# EasyEDA Pro project ProPrj_stm32f103rct6拓展版_2026-05-28.epro

# Schematic Schematic1
Board Name: Board1; Create Date: 2026-05-18; Page Name: P1; Project Name: stm32f103rct6拓展版; Schematic Name: Schematic1; Update Date: 2026-05-19; Company: 嘉立创EDA; Page Size: A4; Version: V1.0
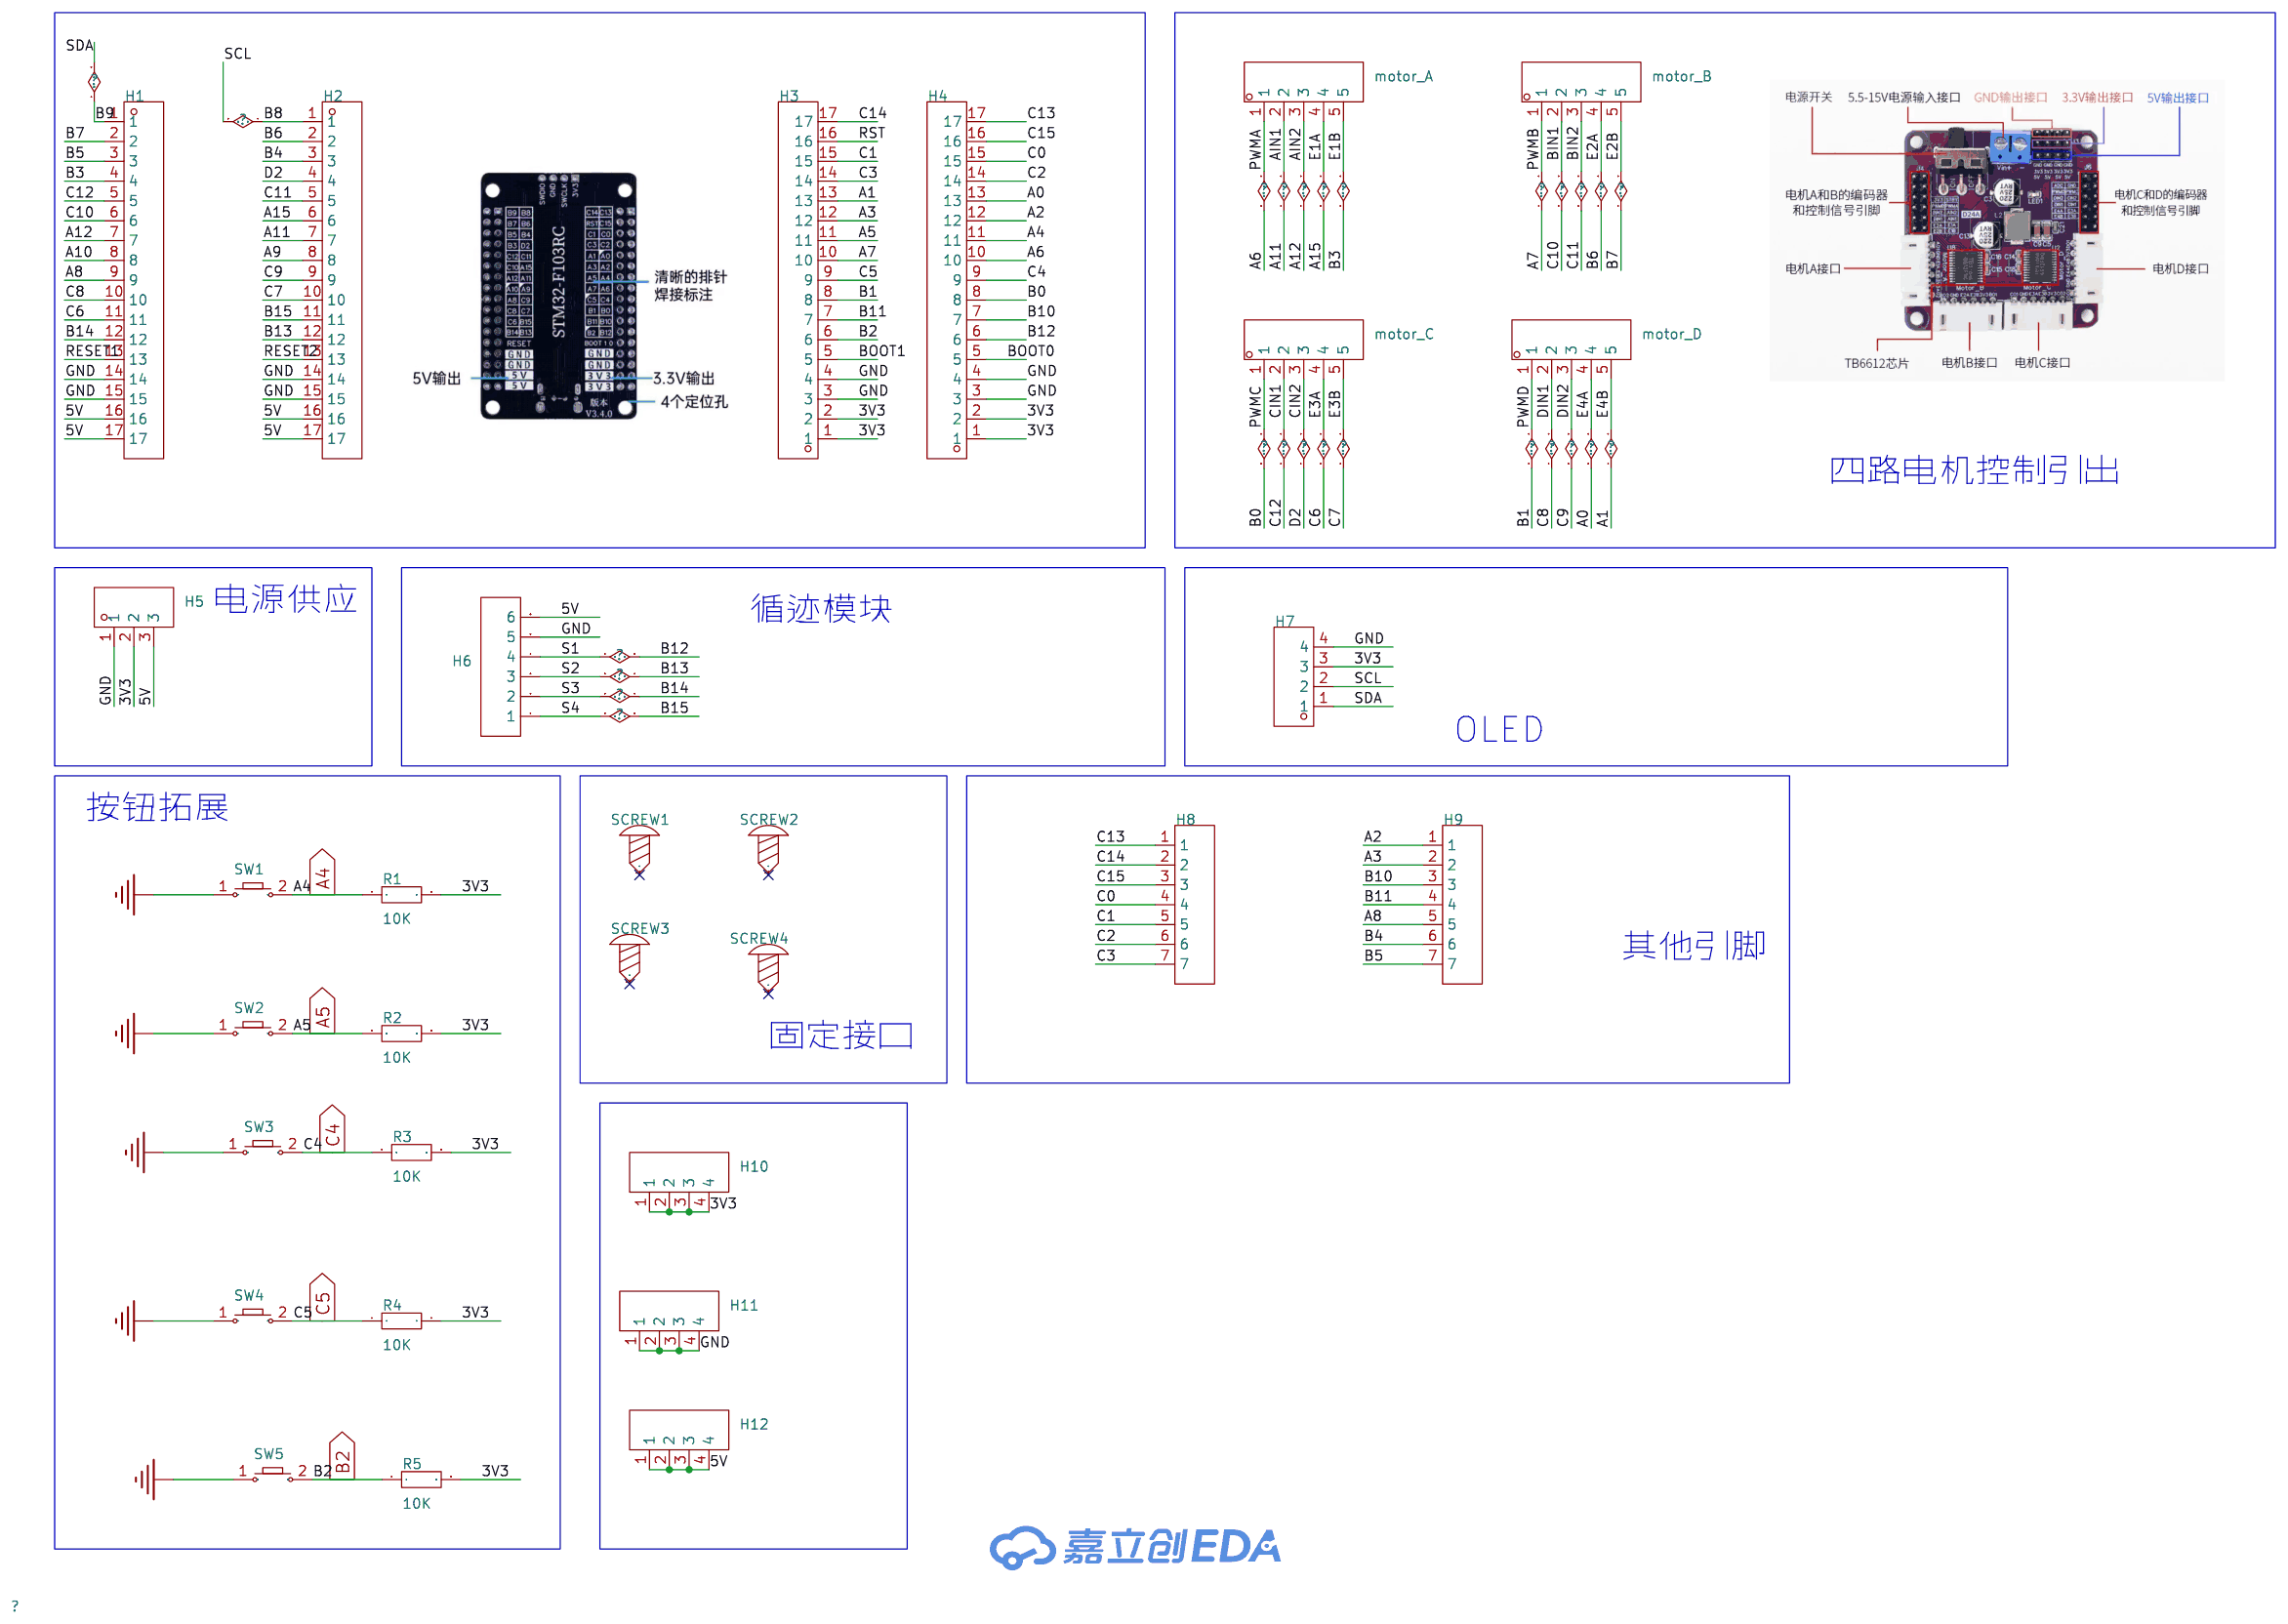
[diagram p0: schematic sheet]

## Parts
H1  -  [HDR-TH_17P-P2.54-V-F]
H2  -  [HDR-TH_17P-P2.54-V-F]
H3  -  [HDR-TH_17P-P2.54-V-F]
H4  -  [HDR-TH_17P-P2.54-V-F]
H5  -  [HDR-TH_3P-P2.54-V-M]
H6  -  [HDR-TH_6P-P2.54-V-M-1]
H7  -  [HDR-TH_4P-P2.54-V-F]
H8  -  [HDR-TH_7P-P2.54-V-M]
H9  -  [HDR-TH_7P-P2.54-V-M]
H10  -  [HDR-TH_4P-P2.54-V-M]
H11  -  [HDR-TH_4P-P2.54-V-M]
H12  -  [HDR-TH_4P-P2.54-V-M]
motor_A  -  [HDR-TH_5P-P2.54-V-M]
motor_B  -  [HDR-TH_5P-P2.54-V-M]
motor_C  -  [HDR-TH_5P-P2.54-V-M]
motor_D  -  [HDR-TH_5P-P2.54-V-M]
R1  10K  [R0805]
R2  10K  [R0805]
R3  10K  [R0805]
R4  10K  [R0805]
R5  10K  [R0805]
SCREW1  -  [M3螺丝]
SCREW2  -  [M3螺丝]
SCREW3  -  [M3螺丝]
SCREW4  -  [M3螺丝]
SW1  -  [Key_SMD_3x4x2]
SW2  -  [Key_SMD_3x4x2]
SW3  -  [Key_SMD_3x4x2]
SW4  -  [Key_SMD_3x4x2]
SW5  -  [Key_SMD_3x4x2]

## Library data of the parts
H1-H4 = HDR-F_2.54_1x17P: Supplier Part: C2897380; Supplier Footprint: 插件
H5 = HDR-M_2.54_1x3P: Supplier Part: C2937625; Supplier Footprint: 插件
H6 = HDR-M_2.54_1x6P: Supplier Part: C37208; Supplier Footprint: 插件
H7 = HDR-F_2.54_1x4P: Supplier Part: C2718488; Supplier Footprint: 插件
H8 H9 = HDR-M_2.54_1x7P: Supplier Part: C492406; Supplier Footprint: 插件
H10-H12 = HDR-M_2.54_1x4P: Supplier Part: C492403; Supplier Footprint: 插件
motor_A motor_B motor_C motor_D = HDR-M_2.54_1x5P: Supplier Part: C358687; Supplier Footprint: 插件
R1-R5 = Res_0805: Supplier Footprint: 0805
SCREW1-SCREW4 = M3螺丝: Supplier Footprint: 插件
SW1-SW5 = Key_SMD_3x4x2: Supplier Footprint: SMD

## Nets
3V3: H3.1 H3.2 H4.1 H4.2 H5.2 H7.3 H10.1 H10.2 H10.3 H10.4 R1.2 R2.2 R3.2 R4.2 R5.2
5V: H1.16 H1.17 H2.16 H2.17 H5.3 H6.6 H12.1 H12.2 H12.3 H12.4
GND: H1.14 H1.15 H2.14 H2.15 H3.3 H3.4 H4.3 H4.4 H5.1 H6.5 H7.4 H11.1 H11.2 H11.3 H11.4 SW1.1 SW2.1 SW3.1 SW4.1 SW5.1
A0: H4.13 motor_D.4
A1: H3.13 motor_D.5
A2: H4.12 H9.1
A3: H3.12 H9.2
A4: H4.11 R1.1 SW1.2
A5: H3.11 R2.1 SW2.2
A6: H4.10 motor_A.1
A7: H3.10 motor_B.1
A8: H1.9 H9.5
A9: H2.8
A10: H1.8
A11: H2.7 motor_A.2
A12: H1.7 motor_A.3
A15: H2.6 motor_A.4
B0: H4.8 motor_C.1
B1: H3.8 motor_D.1
B2: H3.6 R5.1 SW5.2
B3: H1.4 motor_A.5
B4: H2.3 H9.6
B5: H1.3 H9.7
B6: H2.2 motor_B.4
B7: H1.2 motor_B.5
B8: H2.1 H7.2
B9: H1.1 H7.1
B10: H4.7 H9.3
B11: H3.7 H9.4
B12: H4.6 H6.4
B13: H2.12 H6.3
B14: H1.12 H6.2
B15: H2.11 H6.1
BIN1: H1.6 motor_B.2
BIN2: H2.5 motor_B.3
BOOT0: H4.5
BOOT1: H3.5
C0: H4.15 H8.4
C1: H3.15 H8.5
C2: H4.14 H8.6
C3: H3.14 H8.7
C4: H4.9 R3.1 SW3.2
C5: H3.9 R4.1 SW4.2
C6: H1.11 motor_C.4
C7: H2.10 motor_C.5
C8: H1.10 motor_D.2
C9: H2.9 motor_D.3
C12: H1.5 motor_C.2
C13: H4.17 H8.1
C14: H3.17 H8.2
C15: H4.16 H8.3
CIN2: H2.4 motor_C.3
RESET1: H1.13
RESET2: H2.13
RST: H3.16

Not connected (* = marked no-connect by the designer): SCREW1 1*; SCREW2 1*; SCREW3 1*; SCREW4 1*

## Notes on the sheet
- 四路电机控制引出
- 电源供应
- 循迹模块
- OLED
- 按钮拓展
- 其他引脚
- 固定接口

# Board PCB1
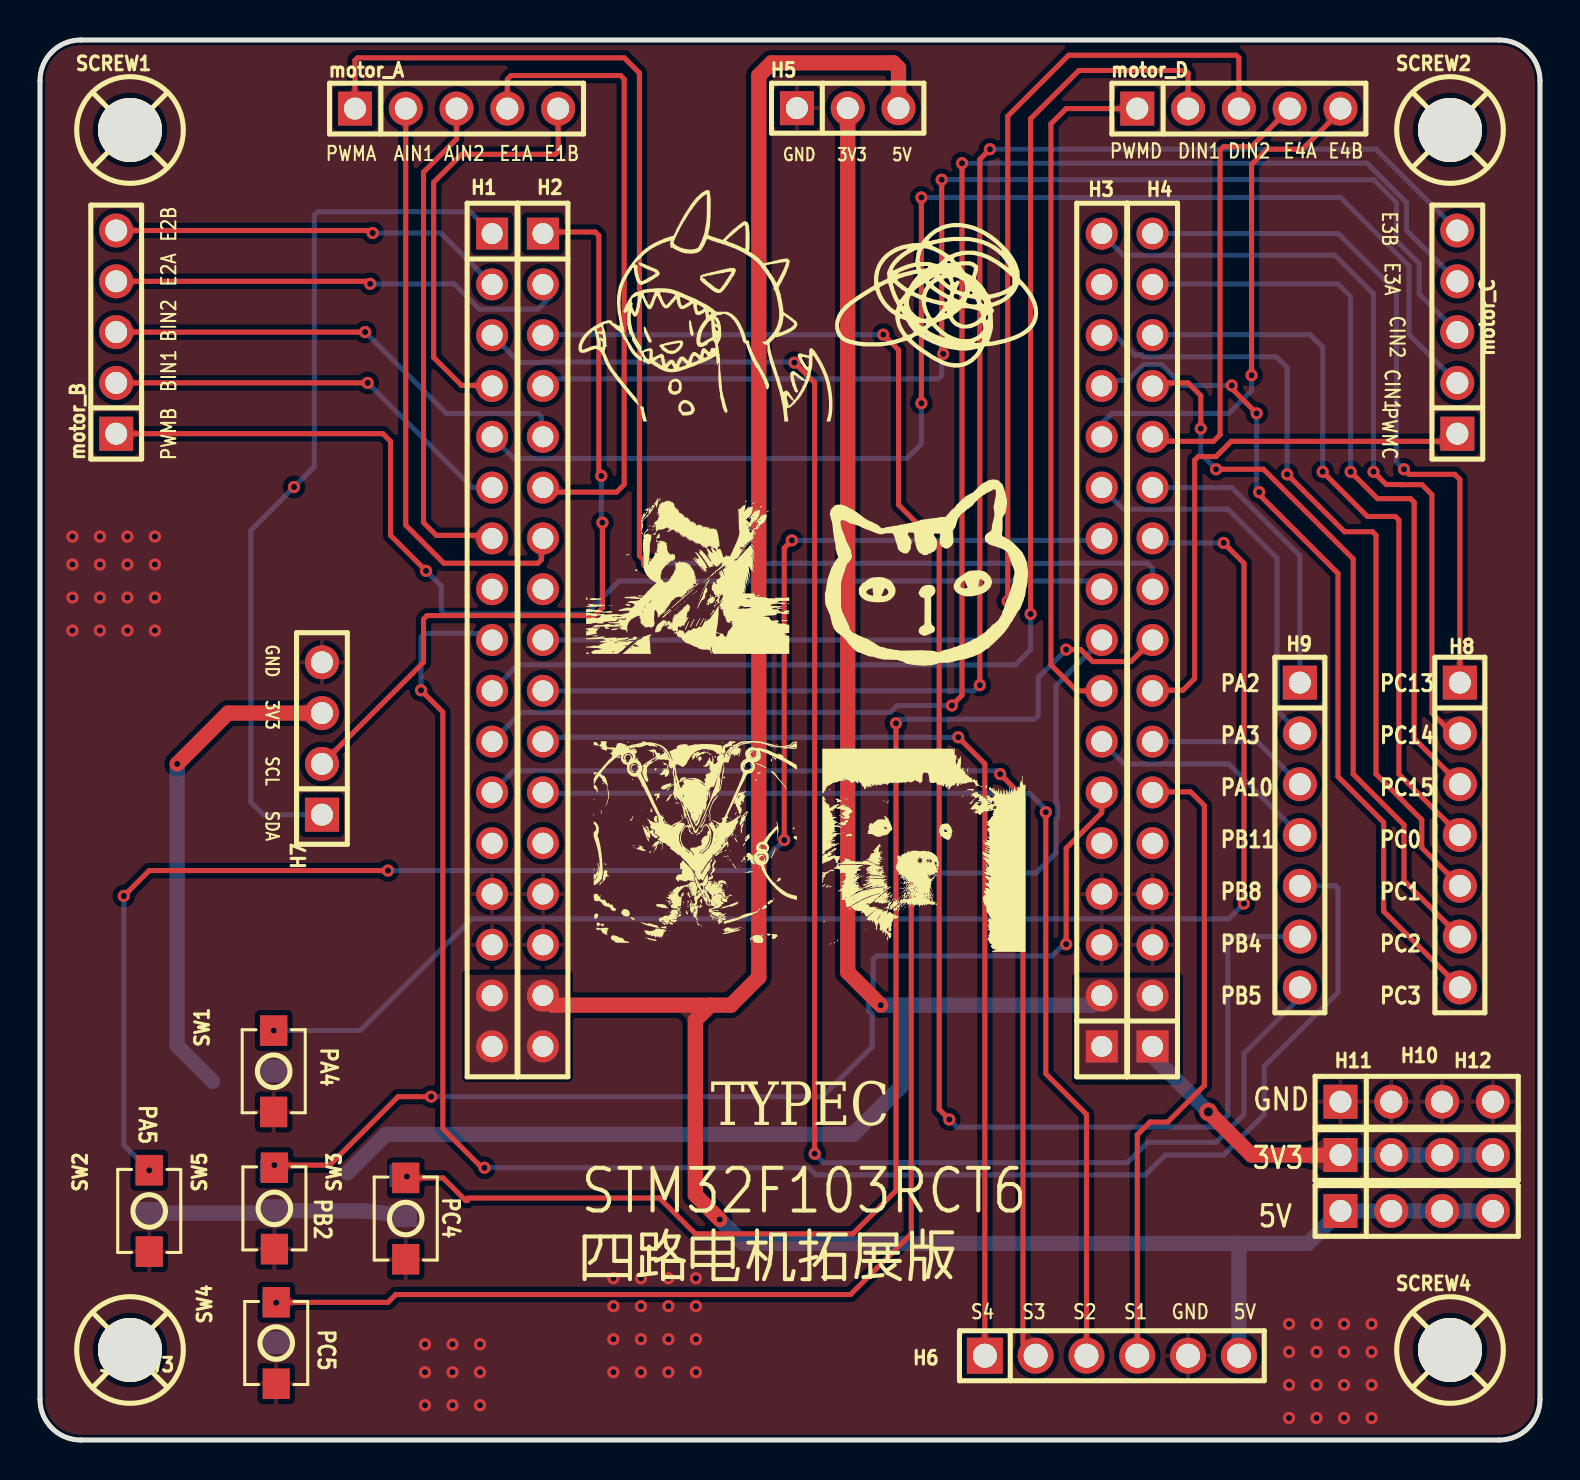
[diagram p1: board, top side]
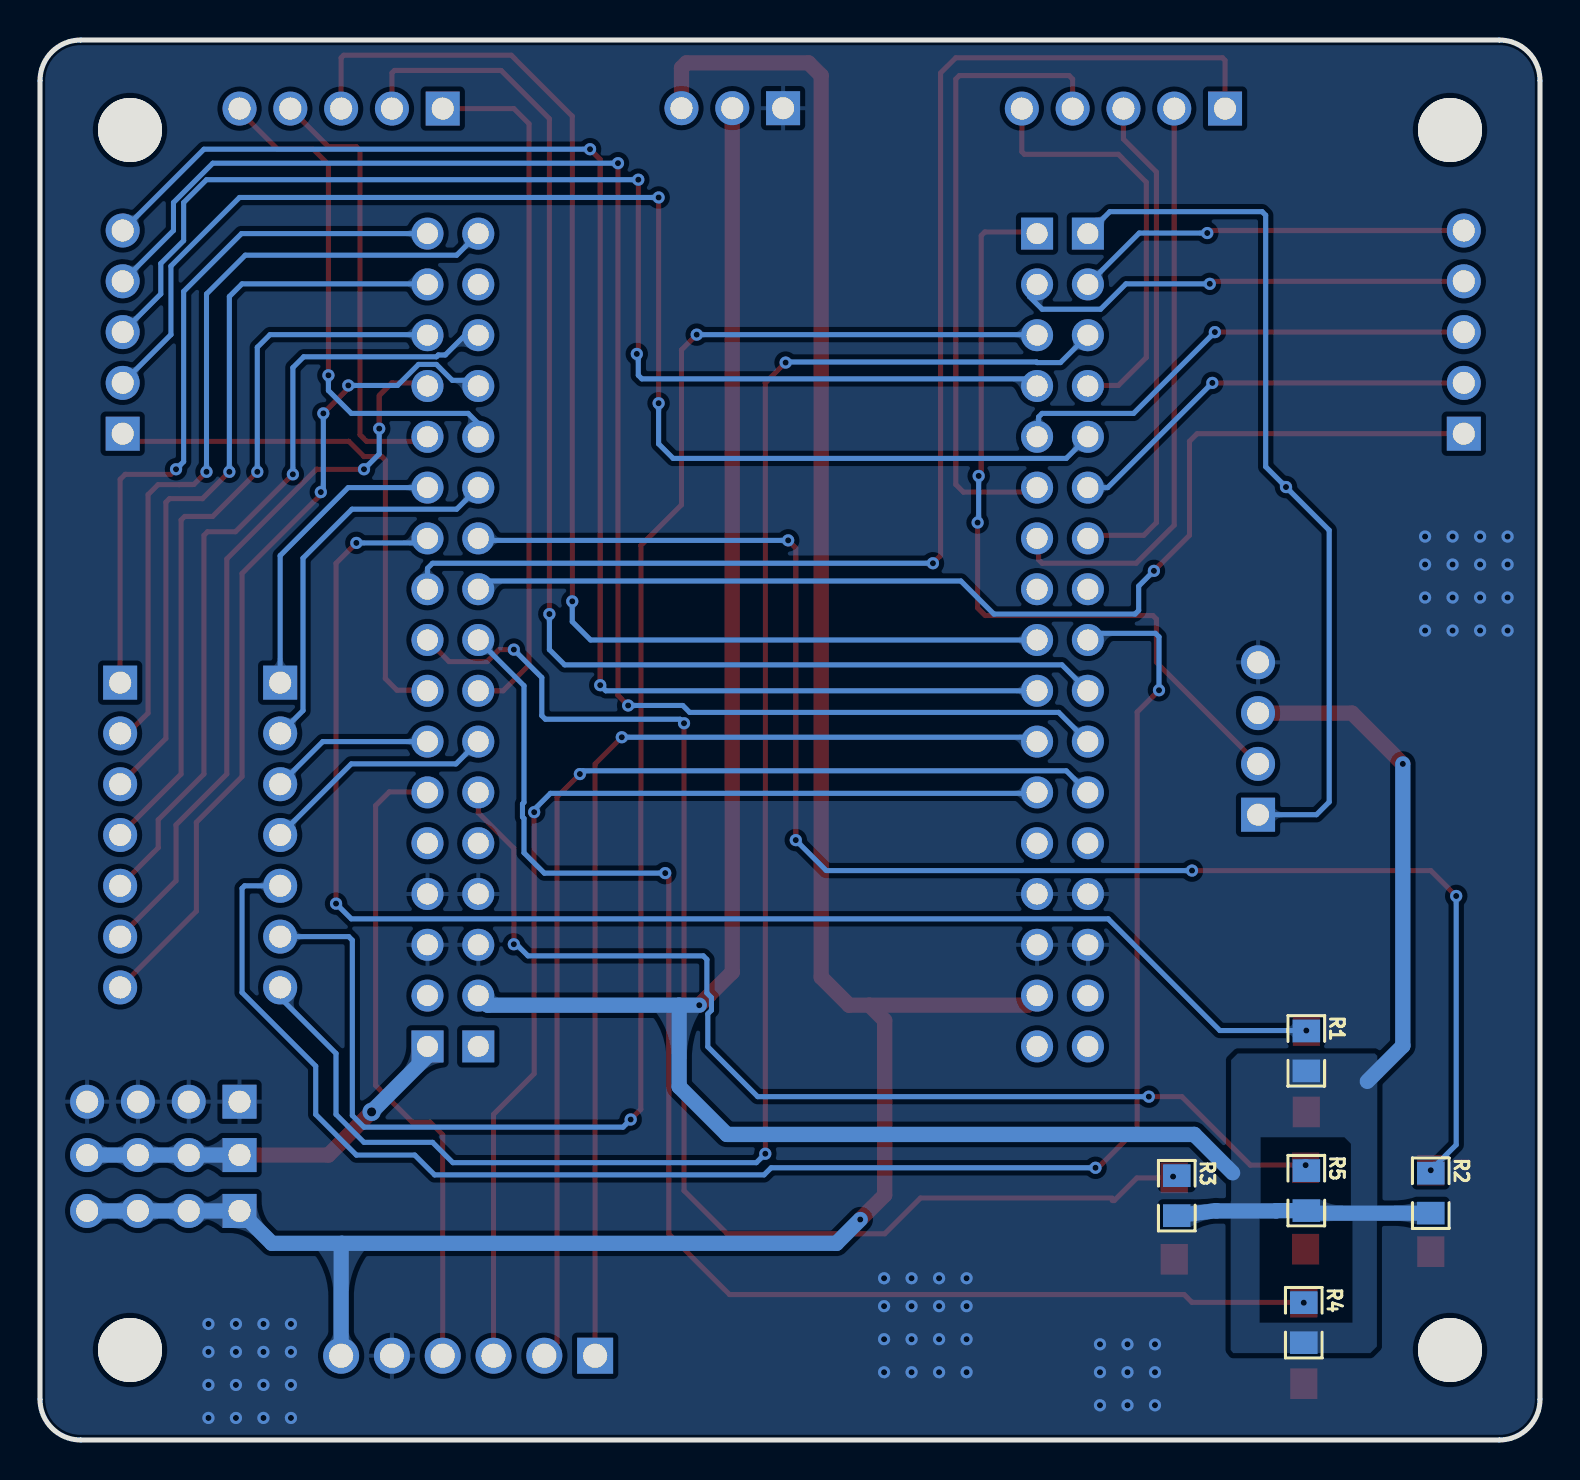
[diagram p2: board, bottom side, seen from below]

Outline 75 x 70 mm; copper layers: Top Layer, Bottom Layer. Coordinates in mm from the lower left corner of the outline.
Outline path: 0,67.97 0,2.03 arc(0.6,0.6) 2.03,0 72.97,0 arc(74.4,0.6) 75,2.03 75,67.97 arc(74.4,69.4) 72.97,70 2.03,70 arc(0.6,69.4) 0,67.97
Stack: Top Layer 0.035mm / Dielectric1 1.51mm FR4 er 4.5 / Bottom Layer 0.035mm

## Design rules (mm)
template: JLCPCB Capability(Two Layers Board)
spacing copperThickness1oz (default): track to track 0.102, other pairs 0.152 to 0.3
spacing copperThickness2oz: track to track 0.203, other pairs 0.152 to 0.3
track width copperThickness1oz (default): min 0.127, default 0.254, max 2.54
track width copperThickness2oz: min 0.203, default 0.254, max 2.54
differential pair differentialPair (default): width min 0.127, default 0.254, max 2.54; gap min 0.152, default 0.152
via viaSize (default): diameter min 0.5, default 0.61, max 10; hole min 0.3, default 0.305, max 6.3

## Placement (name value [footprint] x y rotation side)
H1  -  [HDR-TH_17P-P2.54-V-F]  22.61 40 270 top
H2  -  [HDR-TH_17P-P2.54-V-F]  25.15 40 270 top
H3  -  [HDR-TH_17P-P2.54-V-F]  53.09 40 90 top
H4  -  [HDR-TH_17P-P2.54-V-F]  55.63 40 90 top
H5  -  [HDR-TH_3P-P2.54-V-M]  40.39 66.59 0 top
H6  -  [HDR-TH_6P-P2.54-V-M-1]  53.59 4.21 0 top
H7  -  [HDR-TH_4P-P2.54-V-F]  14.1 35.08 90 top
H8  -  [HDR-TH_7P-P2.54-V-M]  70.99 30.25 270 top
H9  -  [HDR-TH_7P-P2.54-V-M]  62.99 30.25 270 top
H10  -  [HDR-TH_4P-P2.54-V-M]  68.83 14.25 0 top
H11  -  [HDR-TH_4P-P2.54-V-M]  68.83 16.91 0 top
H12  -  [HDR-TH_4P-P2.54-V-M]  68.83 11.45 0 top
motor_A  -  [HDR-TH_5P-P2.54-V-M]  20.83 66.57 0 top
motor_B  -  [HDR-TH_5P-P2.54-V-M]  3.81 55.39 90 top
motor_C  -  [HDR-TH_5P-P2.54-V-M]  70.87 55.39 90 top
motor_D  -  [HDR-TH_5P-P2.54-V-M]  59.94 66.57 0 top
R1  10K  [R0805]  11.68 19.45 270 bottom
R2  10K  [R0805]  5.46 12.34 270 bottom
R3  10K  [R0805]  18.16 12.22 270 bottom
R4  10K  [R0805]  11.81 5.87 270 bottom
R5  10K  [R0805]  11.68 12.47 270 bottom
SCREW1  -  [M3螺丝]  4.5 65.5 0 top
SCREW2  -  [M3螺丝]  70.5 65.5 0 top
SCREW3  -  [M3螺丝]  4.5 4.5 0 top
SCREW4  -  [M3螺丝]  70.5 4.5 0 top
SW1  -  [Key_SMD_3x4x2]  11.68 18.44 90 top
SW2  -  [Key_SMD_3x4x2]  5.46 11.45 90 top
SW3  -  [Key_SMD_3x4x2]  18.29 11.07 90 top
SW4  -  [Key_SMD_3x4x2]  11.81 4.85 90 top
SW5  -  [Key_SMD_3x4x2]  11.72 11.58 90 top

## Footprints (pads in the part's own frame, mm; a bottom-side part is the same pattern mirrored in y, then rotated)
HDR-TH_3P-P2.54-V-M
  rect 1.7x1.7 hole 1.1: 1(-2.54,0)
  round 1.7 hole 1.1: 2(0,0) 3(2.54,0)
HDR-TH_4P-P2.54-V-F
  rect 1.7x1.7 hole 1.1: 1(-3.81,0)
  round 1.7 hole 1.1: 2(-1.27,0) 3(1.27,0) 4(3.81,0)
HDR-TH_4P-P2.54-V-M
  rect 1.7x1.7 hole 1.1: 1(-3.81,0)
  round 1.7 hole 1.1: 2(-1.27,0) 3(1.27,0) 4(3.81,0)
HDR-TH_5P-P2.54-V-M
  rect 1.7x1.7 hole 1.1: 1(-5.08,0)
  round 1.7 hole 1.1: 2(-2.54,0) 3(0,0) 4(2.54,0) 5(5.08,0)
HDR-TH_6P-P2.54-V-M-1
  rect 1.8x1.8 hole 1.2: 1(-6.35,0)
  round 1.8 hole 1.2: 2(-3.81,0) 3(-1.27,0) 4(1.27,0) 5(3.81,0) 6(6.35,0)
HDR-TH_7P-P2.54-V-M
  rect 1.7x1.7 hole 1.1: 1(-7.62,0)
  round 1.7 hole 1.1: 2(-5.08,0) 3(-2.54,0) 4(0,0) 5(2.54,0) 6(5.08,0) 7(7.62,0)
HDR-TH_17P-P2.54-V-F
  rect 1.6x1.6 hole 1.05: 1(-20.32,0)
  round 1.6 hole 1.05: 2(-17.78,0) 3(-15.24,0) 4(-12.7,0) 5(-10.16,0) 6(-7.62,0) 7(-5.08,0) 8(-2.54,0) 9(0,0) 10(2.54,0) 11(5.08,0) 12(7.62,0) 13(10.16,0) 14(12.7,0) 15(15.24,0) 16(17.78,0) 17(20.32,0)
Key_SMD_3x4x2
  rect 1.53x1.36 smd: 1(-2.035,0) 2(2.035,0)
M3螺丝
  round 3.2 hole 3.2: 1(0,0)
R0805
  rect 1.133x1.377 smd: 1(-1,0) 2(1,0)

## Nets
As in the schematic.

Pads without a net: SCREW1 1; SCREW2 1; SCREW3 1; SCREW4 1

## Via types
v1: diameter 0.61, hole 0.305, Top Layer to Bottom Layer, 115 vias
v2: diameter 0.914, hole 0.457, Top Layer to Bottom Layer, 1 via

## Routing (per net, layer and track width the routed paths; a pad name or vN(x,y) marks a point on that pad's centre or on a via; arc(x,y) is an arc through that point)
3V3: length 147.6
  Top Layer w0.762: v1(42.04,21.74) 40.39,23.39 H5.2 ; H7.3 9.4,36.34 v1(6.86,33.81) ; v2(58.42,16.41) 60.58,14.25 H10.1
  Bottom Layer w0.762: 15.37,13.36 17.29,15.28 40.66,15.28 43.04,17.67 43.04,21.74 ; v2(58.42,16.41) 55.63,19.2 H4.1 ; R2.2 11.56,11.34 R5.2 13.19,11.47 13.2,11.45 16.18,11.45 16.19,11.47 R3.2 ; v1(42.04,21.74) 43.04,21.74 ; 43.04,21.74 52.61,21.74 H3.2 ; 8.64,17.93 6.86,19.71 v1(6.86,33.81) ; H10.4 H10.3 H10.2 H10.1
5V: length 123
  Top Layer w0.762: v1(33.99,11.02) 32.77,12.25 32.77,20.98 33.53,21.74 ; 33.53,21.74 34.54,21.74 35.94,23.14 35.94,68.22 36.58,68.86 42.67,68.86 42.93,68.6 H5.3 ; 33.53,21.74 25.63,21.74 H2.16
  Bottom Layer w0.762: 59.91,9.83 63.4,9.83 H12.1 H12.2 H12.3 H12.4 ; 59.91,9.83 35.18,9.83 v1(33.99,11.02) ; 59.91,9.83 59.94,9.8 H6.6
GND:
  vias: v1(1.62,45.17) v1(1.62,43.77) v1(1.62,42.12) v1(1.62,40.47) v1(3,45.17) v1(3,43.77) v1(3,42.12) v1(3,40.47) v1(4.37,45.17) v1(4.37,43.77) v1(4.37,42.12) v1(4.37,40.47) v1(5.75,45.17) v1(5.75,43.77) v1(5.75,42.12) v1(5.75,40.47) v1(19.25,4.79) v1(19.25,3.39) v1(19.25,1.74) v1(20.63,4.79) v1(20.63,3.39) v1(20.63,1.74) v1(22,4.79) v1(22,3.39) v1(22,1.74) v1(28.67,8.09) v1(28.67,6.69) v1(28.67,5.04) v1(28.67,3.39) v1(30.05,8.09) v1(30.05,6.69) v1(30.05,5.04) v1(30.05,3.39) v1(31.42,8.09) v1(31.42,6.69) v1(31.42,5.04) v1(31.42,3.39) v1(32.8,8.09) v1(32.8,6.69) v1(32.8,5.04) v1(32.8,3.39) v1(62.45,5.8) v1(62.45,4.4) v1(62.45,2.75) v1(62.45,1.1) v1(63.83,5.8) v1(63.83,4.4) v1(63.83,2.75) v1(63.83,1.1) v1(65.2,5.8) v1(65.2,4.4) v1(65.2,2.75) v1(65.2,1.1) v1(66.58,5.8) v1(66.58,4.4) v1(66.58,2.75) v1(66.58,1.1)
A0: length 22.2
  Top Layer w0.254: H4.13 55.85,49.93 58.67,49.93 59,50.26 59,64.49 59.18,64.67 60.58,64.67 motor_D.4
A1: length 25.8
  Top Layer w0.254: motor_D.5 65.02,66.44 63.12,64.54 61.34,64.54 60.58,63.78 v1(60.58,53.24)
  Bottom Layer w0.254: v1(60.58,53.24) 60.58,52.47 59.44,51.33 53.59,51.33 53.09,50.82 H3.13
A2: length 15.1
  Bottom Layer w0.254: H9.1 62.99,44.22 59.59,47.62 H4.12
A3: length 19.5
  Bottom Layer w0.254: H3.12 54.16,46.54 59.4,46.54 61.85,44.09 61.85,36.47 H9.2
A4: length 73.2
  Top Layer w0.254: v1(59.18,44.85) 60.2,43.84 v1(60.2,26.82)
  Bottom Layer w0.254: v1(11.68,20.47) 16,20.47 21.59,26.06 59.44,26.06 v1(60.2,26.82) ; v1(59.18,44.85) 55.85,44.85 H4.11
A5: length 79.1
  Top Layer w0.254: v1(4.19,27.2) 5.46,28.47 v1(17.4,28.47) ; v1(37.59,44.98) 37.21,44.6 v1(37.21,30)
  Bottom Layer w0.254: v1(4.19,27.2) 4.19,14.76 v1(5.46,13.49) ; v1(37.59,44.98) 52.99,44.98 H3.11 ; v1(37.21,30) 35.69,28.47 v1(17.4,28.47)
A6: length 68.1
  Top Layer w0.254: v1(30.35,43.84) 29.97,44.22 29.97,68.35 29.21,69.11 15.88,69.11 15.75,68.98 motor_A.1
  Bottom Layer w0.254: v1(30.35,43.84) 55.37,43.84 55.63,43.58 H4.10
A7: length 57.3
  Top Layer w0.254: motor_B.1 17.14,50.31 17.53,49.93 17.53,45.23 v1(19.3,43.46)
  Bottom Layer w0.254: v1(19.3,43.46) 20.07,42.69 20.07,41.48 20.25,41.3 27.31,41.3 28.96,42.95 52.68,42.95 H3.10
A8: length 86.9
  Top Layer w0.254: v1(22.22,13.61) 22.1,13.61 20.14,15.57 20.14,36.4 v1(19.05,37.49)
  Bottom Layer w0.254: H9.5 64.77,27.71 64.9,27.58 64.9,22.38 61.21,18.69 61.21,16.28 59.18,14.25 56.26,14.25 55.27,13.26 38.8,13.26 38.44,13.61 v1(22.22,13.61) ; H1.9 22.27,40.33 19.23,40.33 19.05,40.16 v1(19.05,37.49)
A11: length 29.6
  Top Layer w0.254: H2.7 25.07,45.01 25.07,44.02 24.89,43.84 20.19,43.84 18.29,45.74 motor_A.2
A12: length 25.1
  Top Layer w0.254: motor_A.3 20.83,65.05 19.18,63.4 19.18,45.87 19.81,45.23 22.45,45.23 H1.7
A15: length 32
  Top Layer w0.254: motor_A.4 23.37,68.04 23.55,68.22 29.03,68.22 29.21,68.04 29.21,47.78 28.83,47.39 25.37,47.39 H2.6
B0: length 27
  Top Layer w0.254: motor_C.1 70.49,49.93 59.56,49.93 58.8,49.17 57.91,49.17 57.73,48.99 57.73,38.07 57.15,37.49 55.65,37.49 H4.8
B1: length 34.8
  Top Layer w0.254: H3.8 51.84,37.46 50.55,38.76 50.55,65.81 51.31,66.57 motor_D.1
B2: length 55.2
  Top Layer w0.254: H3.6 53.09,31.37 51.31,29.59 v1(51.31,24.79) ; v1(19.56,17.17) 17.91,17.17 14.48,13.74 v1(11.72,13.74)
  Bottom Layer w0.254: v1(51.31,24.79) 51.18,24.79 50.6,24.21 41.84,24.21 41.66,24.03 41.66,22.35 41.43,22.12 41.43,21.49 41.61,21.3 41.61,19.66 39.12,17.17 v1(19.56,17.17)
B3: length 21.3
  Top Layer w0.254: motor_A.5 25.91,64.41 25.78,64.28 21.08,64.28 19.69,62.89 19.69,54.12 21.08,52.73 22.58,52.73 H1.4
B4: length 84.4
  Top Layer w0.254: v1(42.16,55.27) 42.93,54.51 42.93,46.76 44.96,44.73 44.96,16.53 v1(45.47,16.03)
  Bottom Layer w0.254: H2.3 25.17,55.27 v1(42.16,55.27) ; v1(45.47,16.03) 45.85,15.64 58.8,15.64 59.38,16.23 59.38,24.99 59.56,25.17 H9.6
B5: length 85.8
  Top Layer w0.254: v1(38.74,14.31) 38.74,52.86 v1(37.72,53.87)
  Bottom Layer w0.254: H9.7 62.99,22.12 60.2,19.33 60.2,16.28 58.8,14.88 55.37,14.88 54.36,13.87 39.18,13.87 v1(38.74,14.31) ; v1(37.72,53.87) 37.69,53.9 25.18,53.9 25.15,53.87 23.97,53.87 H1.3
B6: length 23.3
  Top Layer w0.254: v1(16.51,57.81) 16.38,57.94 motor_B.4
  Bottom Layer w0.254: v1(16.51,57.81) 20.7,57.81 21.97,56.54 24.89,56.54 25.53,57.17 25.53,57.28 25.15,57.66 H2.2
B7: length 19.9
  Top Layer w0.254: v1(16.64,60.35) 16.51,60.47 motor_B.5
  Bottom Layer w0.254: H1.2 20.04,60.35 v1(16.64,60.35)
B8: length 40.1
  Top Layer w0.254: H7.2 19.18,38.89 19.18,41.04 19.36,41.22 27.74,41.22 28.12,41.6 v1(28.12,45.87) ; H2.1 25.23,60.4 27.76,60.4 27.94,60.22 27.94,48.33 v1(28.07,48.2)
  Bottom Layer w0.254: 28.07,48.16 28.07,45.92 v1(28.12,45.87)
B9: length 43.9
  Bottom Layer w0.254: H1.1 21.51,61.42 13.9,61.42 13.72,61.24 13.72,48.66 v1(12.7,47.65) 10.54,45.49 10.54,31.9 11.18,31.27 H7.1
B10: length 8.2
  Bottom Layer w0.254: H4.7 60.86,34.92 H9.3
B11: length 11.8
  Bottom Layer w0.254: H3.7 54.2,33.81 59.44,33.81 H9.4
B12: length 32.3
  Top Layer w0.254: H4.6 55.65,32.41 57.53,32.41 58.22,31.72 58.22,17.73 56.39,15.9 55.5,15.9 54.86,15.26 H6.4
B13: length 53.6
  Top Layer w0.254: H6.3 52.32,16.28 50.29,18.31 v1(50.29,31.39)
  Bottom Layer w0.254: H2.12 25.19,32.33 49.48,32.33 50.29,31.52 v1(50.29,31.39)
B14: length 55.7
  Top Layer w0.254: H6.2 49.15,4.85 49.15,32.15 v1(48.01,33.3)
  Bottom Layer w0.254: v1(48.01,33.3) 47.84,33.46 23.69,33.46 H1.12
B15: length 52.3
  Top Layer w0.254: H6.1 47.24,33.81 v1(45.91,35.14)
  Bottom Layer w0.254: v1(45.91,35.14) 25.36,35.14 H2.11
BIN1: length 21
  Top Layer w0.254: 3.81,52.86 v1(16.38,52.86)
  Bottom Layer w0.254: H1.6 21.62,47.62 v1(16.38,52.86)
BIN2: length 24
  Top Layer w0.254: motor_B.3 v1(16.26,55.39)
  Bottom Layer w0.254: H2.5 25.07,50.23 25.07,51.15 24.89,51.33 20.32,51.33 v1(16.26,55.39)
C0: length 36.8
  Top Layer w0.254: v1(64.13,48.41) 66.37,46.18 67.77,46.18 67.94,46 67.94,33.3 H8.4
  Bottom Layer w0.254: v1(64.13,48.41) 64.13,54.63 63.5,55.27 55.65,55.27 H4.15
C1: length 40.2
  Top Layer w0.254: v1(62.36,48.28) 65.23,45.41 66.62,45.41 66.8,45.23 66.8,33.3 69.09,31.01 69.09,29.61 H8.5
  Bottom Layer w0.254: v1(62.36,48.28) 62.36,53.62 61.81,54.16 55.18,54.16 55.09,54.25 54.74,54.25 53.75,55.24 H3.15
C2: length 36.5
  Top Layer w0.254: H4.14 55.78,52.86 57.4,52.86 58.04,52.22 v1(58.04,50.57) ; v1(58.8,48.54) 61.18,48.54 65.66,44.05 65.66,33.3 68.2,30.76 68.2,27.96 H8.6
  Bottom Layer w0.254: v1(58.8,48.54) 58.04,49.3 v1(58.04,50.57)
C3: length 42.2
  Top Layer w0.254: H8.7 67.18,26.44 67.18,30.88 64.9,33.17 64.9,43.33 60.96,47.27 v1(60.96,47.39) ; v1(60.83,51.33) 59.59,52.58 v1(59.59,52.73)
  Bottom Layer w0.254: v1(59.59,52.73) 57.12,52.73 56.07,53.78 55.18,53.78 54.38,52.98 53.37,52.98 H3.14 ; v1(60.83,51.33) 60.83,47.52 v1(60.96,47.39)
C4: length 66.2
  Top Layer w0.254: 21.39,12.1 30.98,12.1 32.77,10.31 40.64,10.31 42.8,12.47 42.8,35.96 ; v1(18.35,13.17) 18.41,13.1 20.15,13.1 21.29,11.97 21.39,11.97 ; v1(51.31,39.52) 52.04,39.52 52.64,38.92 54.55,38.92 H4.9
  Bottom Layer w0.254: v1(42.8,35.84) 43,36.04 49.73,36.04 49.91,36.22 49.91,38.12 v1(51.31,39.52)
C5: length 70.4
  Top Layer w0.254: SW4.2 17.4,6.88 17.79,7.27 40.53,7.27 43.56,10.31 43.56,28.17 v1(43.74,28.34)
  Bottom Layer w0.254: H3.9 50.8,37.71 50.8,31.88 50.88,31.81 50.88,31.15 50.8,31.07 50.8,29.36 49.78,28.34 v1(43.74,28.34)
  vias: v1(11.81,6.87)
C6: length 79.1
  Top Layer w0.254: v1(45.59,36.73) 46.1,37.23 v1(46.1,63.84)
  Bottom Layer w0.254: motor_C.4 68.33,60.47 68.33,61.87 66.36,63.84 v1(46.1,63.84) ; v1(45.59,36.73) 42.86,36.73 42.52,36.38 24.07,36.38 H1.11
C7: length 74
  Top Layer w0.254: v1(46.99,37.74) 46.99,64.03 v1(47.5,64.54)
  Bottom Layer w0.254: v1(46.99,37.74) 46.71,37.46 H2.10 ; v1(47.5,64.54) 66.8,64.54 motor_C.5
C8: length 65
  Top Layer w0.254: v1(49.53,41.3) 49.53,66.06 51.94,68.48 57.28,68.48 57.4,68.35 motor_D.2
  Bottom Layer w0.254: v1(49.53,41.3) 49.53,39.52 48.77,38.76 23.9,38.76 H1.10
C9: length 64.3
  Top Layer w0.254: v1(48.39,41.93) 48.39,66.19 51.44,69.24 59.82,69.24 59.94,69.11 motor_D.3
  Bottom Layer w0.254: v1(48.39,41.93) 48.39,40.92 47.47,40 H2.9
C12: length 67.2
  Top Layer w0.254: v1(44.07,62.13) v1(44.07,51.84)
  Bottom Layer w0.254: v1(44.07,62.13) 65.02,62.13 68.45,58.7 68.45,55.27 70.87,52.86 ; v1(44.07,51.84) 44.07,49.81 43.34,49.08 23.69,49.08 H1.5
C13: length 35.6
  Top Layer w0.254: H8.1 70.99,48.03 70.74,48.28 68.45,48.28 v1(68.2,48.54)
  Bottom Layer w0.254: v1(68.2,48.54) 67.82,48.92 67.82,57.43 64.93,60.32 H4.17
C14: length 39.9
  Top Layer w0.254: v1(66.68,48.41) 67.31,47.78 68.03,47.78 68.04,47.77 69.1,47.77 69.6,47.27 69.6,36.34 70.61,35.33 H8.2
  Bottom Layer w0.254: H3.17 54.16,59.24 64.73,59.24 66.68,57.3 v1(66.68,48.41)
C15: length 37.8
  Top Layer w0.254: H8.3 68.71,35.08 68.71,46.89 68.53,47.07 66.88,47.07 v1(65.53,48.41)
  Bottom Layer w0.254: v1(65.53,48.41) 65.53,57.17 64.9,57.81 55.65,57.81 H4.16
CIN2: length 60.9
  Top Layer w0.254: v1(45.09,63.02) 45.09,54.38 v1(45.16,54.3)
  Bottom Layer w0.254: v1(45.16,54.3) 45.09,54.23 45.09,53.24 44.91,53.06 25.5,53.06 H2.4 ; motor_C.3 68.96,57.3 68.96,58.82 67.82,59.97 67.82,61.87 66.68,63.02 v1(45.09,63.02)

## Copper pours and planes (outline as drawn; the poured copper is in the pictures)
3V3 on Top Layer: 51.86,23.12 56.9,23.12 56.9,18.02 51.86,18.02
3V3 on Bottom Layer: 8.14,19.33 15.44,19.33 15.44,11.34 8.14,11.34
3V3 on Bottom Layer: 8.16,12.33 15.47,12.33 15.47,4.34 8.16,4.34
5V on Top Layer: 21.36,23.26 26.4,23.26 26.4,18.16 21.36,18.16
GND on Top Layer: -33.91,91.21 107.06,91.21 107.06,-17.5 -33.91,-17.5
GND on Bottom Layer: -19.56,103.4 104.9,103.4 104.9,-15.6 -19.56,-15.6

Small or netless copper shapes (teardrops, artwork), in the pictures only: 98 on Top Layer, 120 on Bottom Layer

## Text on the board
Top Silkscreen Layer: GND | 3V3 | SCL | SDA | 5V | PWMA | AIN1 | AIN2 | E1A | E1B | S4 | S3 | S2 | PWMD | S1 | DIN1 | DIN2 | E4A | E4B | E2B | E2A | BIN2 | BIN1 | PWMB | E3B | PWMC | E3A | CIN1 | CIN2 | PA2 | PA3 | PA10 | PB11 | PB8 | PB4 | PB5 | PC13 | PC14 | PC15 | PC0 | PC1 | PC2 | PC3 | PA5 | PB2 | PC5 | PA4 | PC4 | STM32F103RCT6 / 四路电机拓展版 | TYPEC
